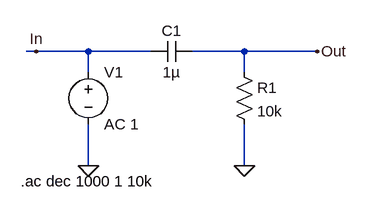
[diagram p0: schematic Filtro_pasaalto.asc]
Filtro_pasaalto.asc, the LTspice schematic file:
Version 4
SHEET 1 880 680
WIRE 0 80 -16 80
WIRE 80 80 0 80
WIRE 176 80 80 80
WIRE 320 80 240 80
WIRE 432 80 320 80
WIRE 80 112 80 80
WIRE 320 112 320 80
WIRE 80 256 80 192
WIRE 320 256 320 192
FLAG 80 256 0
FLAG 320 256 0
FLAG 0 80 In
FLAG 432 80 Out
SYMBOL voltage 80 96 R0
SYMATTR InstName V1
SYMATTR Value AC 1
SYMBOL cap 240 64 R90
WINDOW 0 0 32 VBottom 2
WINDOW 3 32 32 VTop 2
SYMATTR InstName C1
SYMATTR Value 1µ
SYMBOL res 304 96 R0
SYMATTR InstName R1
SYMATTR Value 10k
TEXT -24 280 Left 2 !.ac dec 1000 1 10k

The netlist it stands for:
* Filtro_pasaalto.asc
V1 In 0 AC 1
C1 Out In 1µ
R1 Out 0 10k
.ac dec 1000 1 10k
.backanno
.end